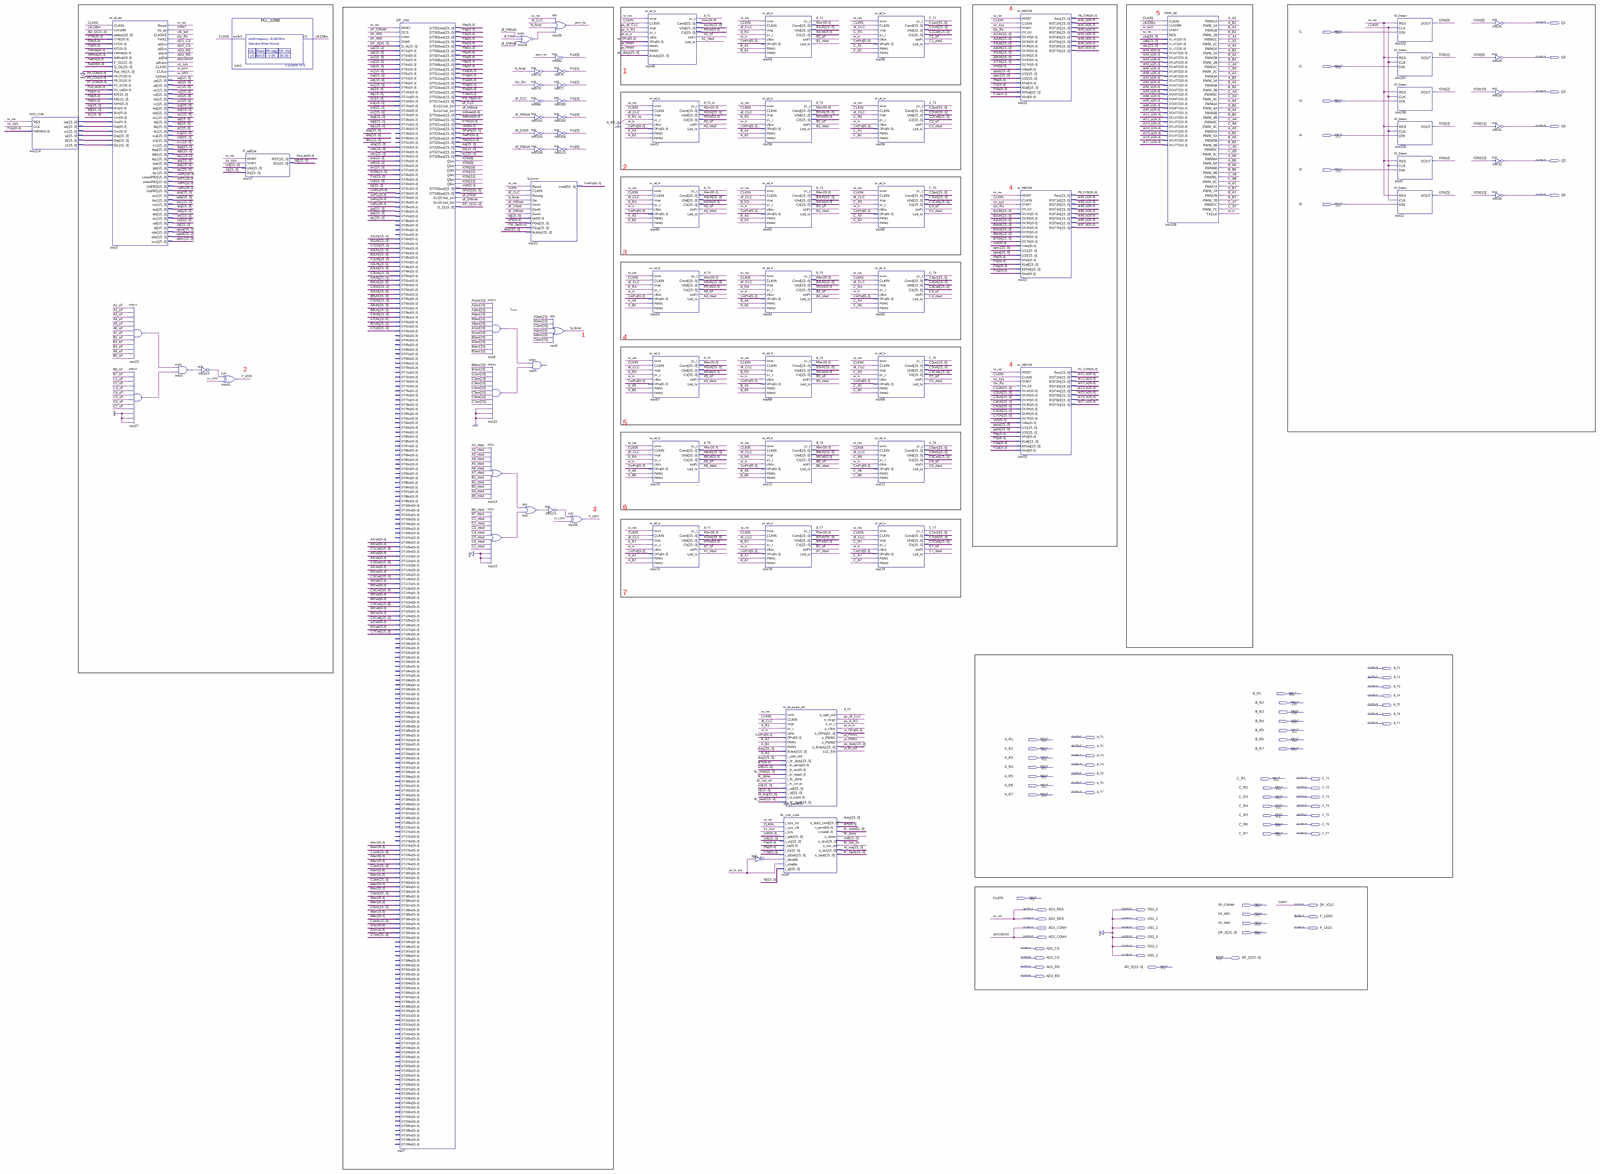
[diagram p0: schematic sheet, whole]
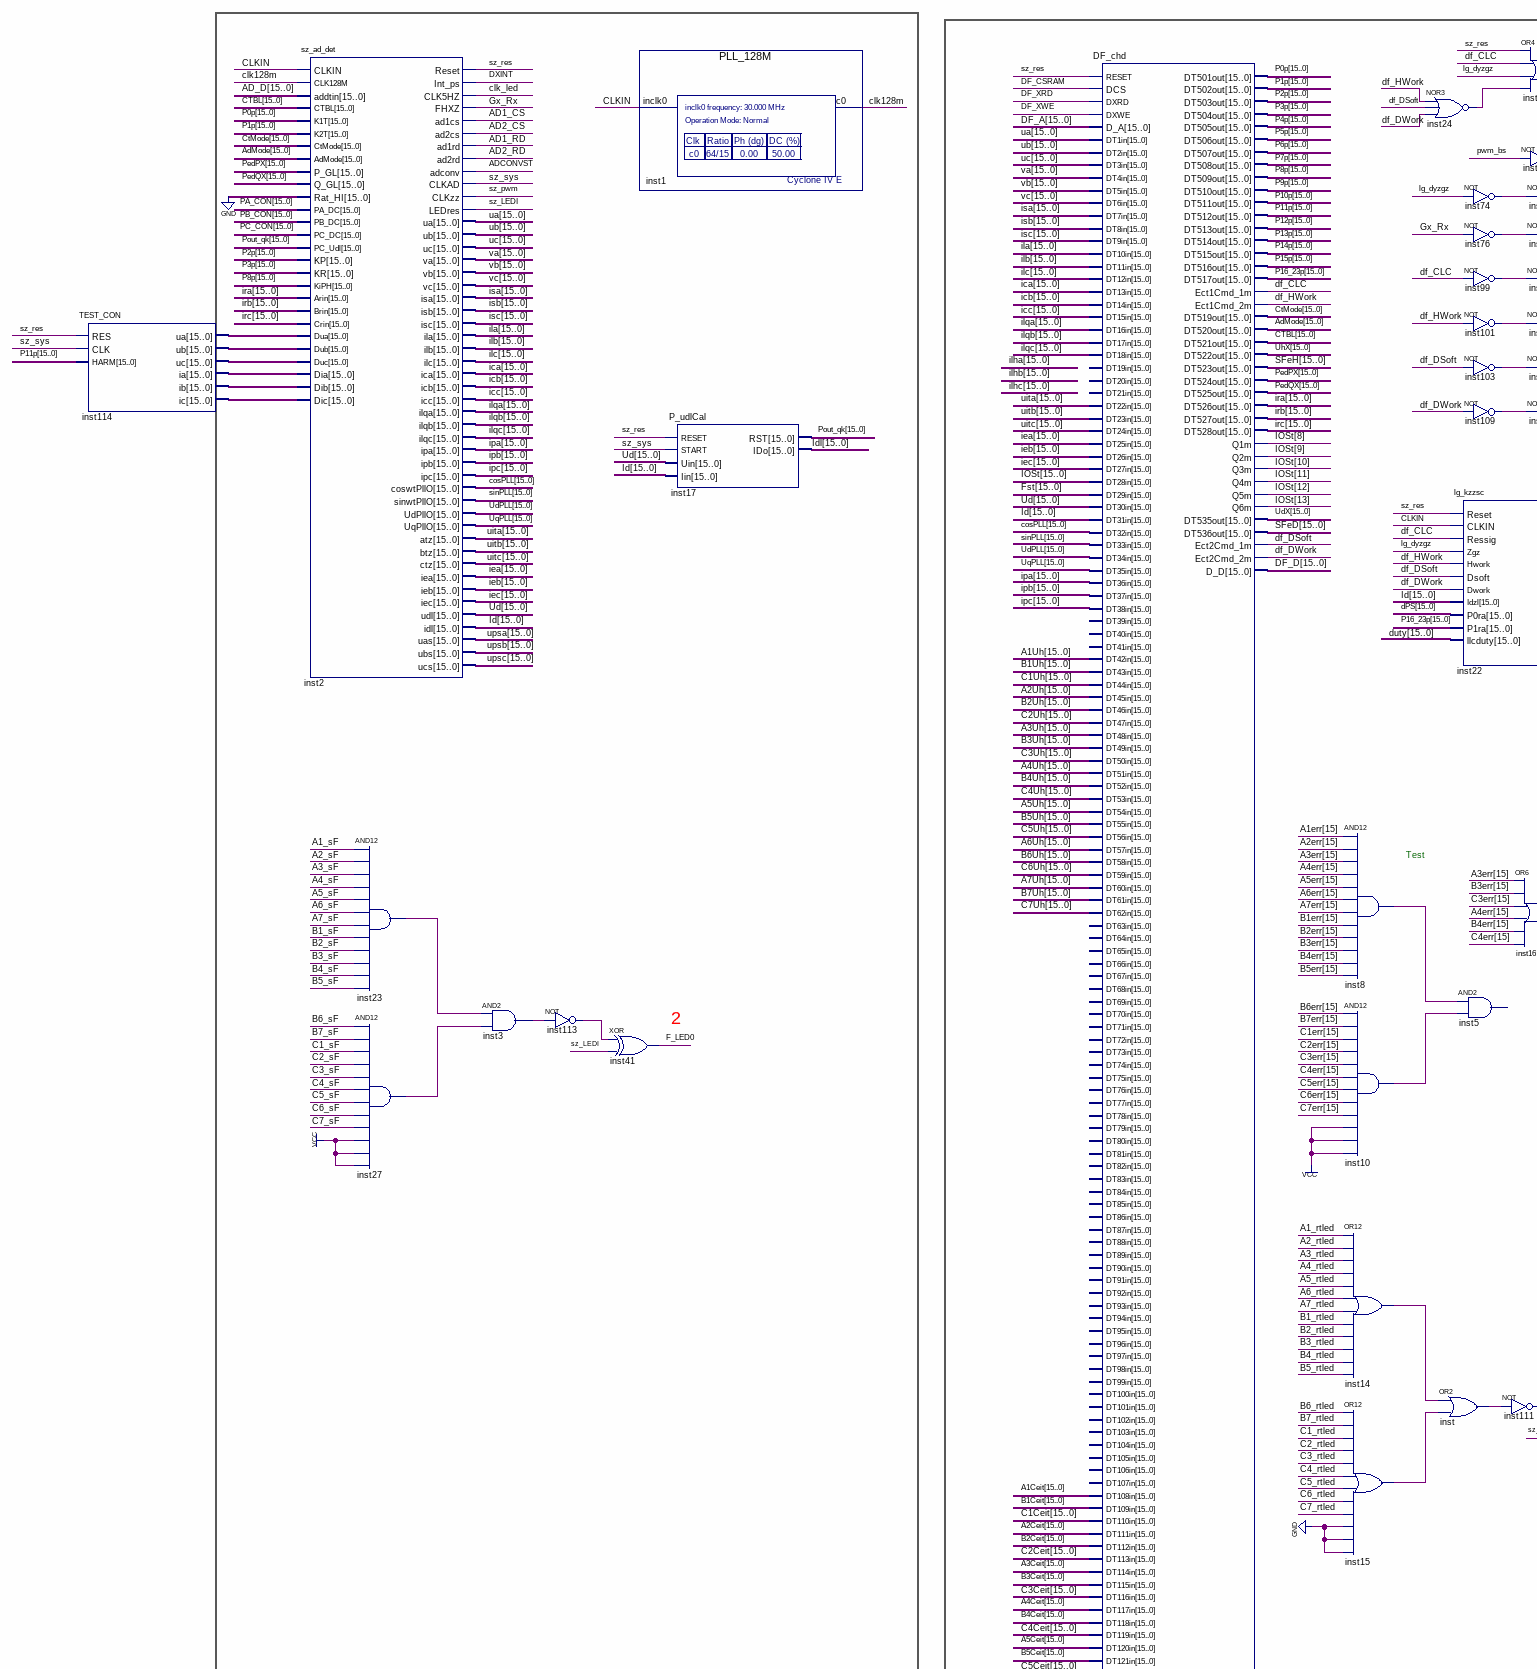
[diagram p1: schematic sheet, upper left part]
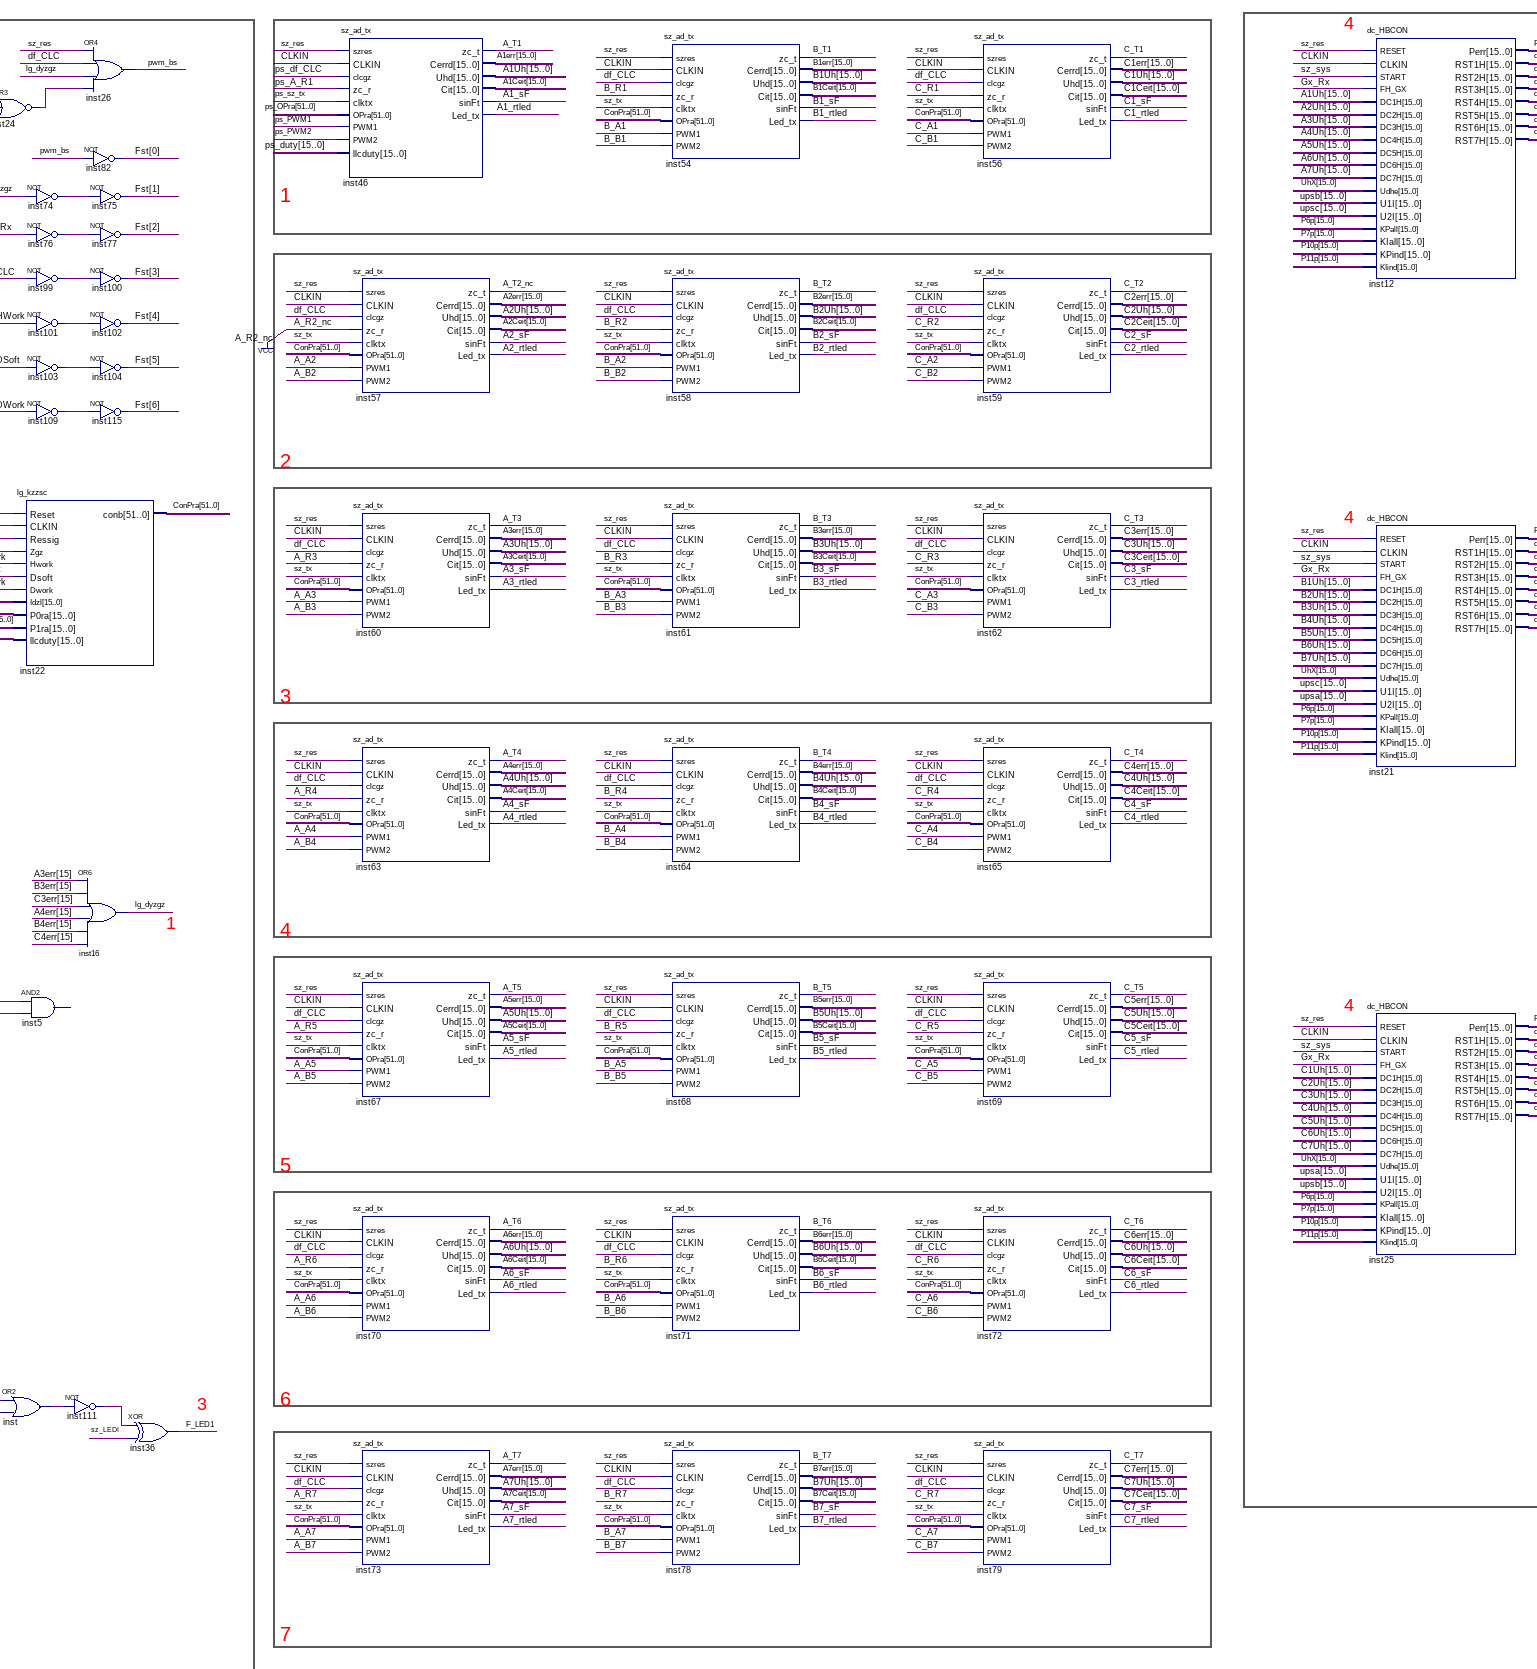
[diagram p2: schematic sheet, upper centre part]
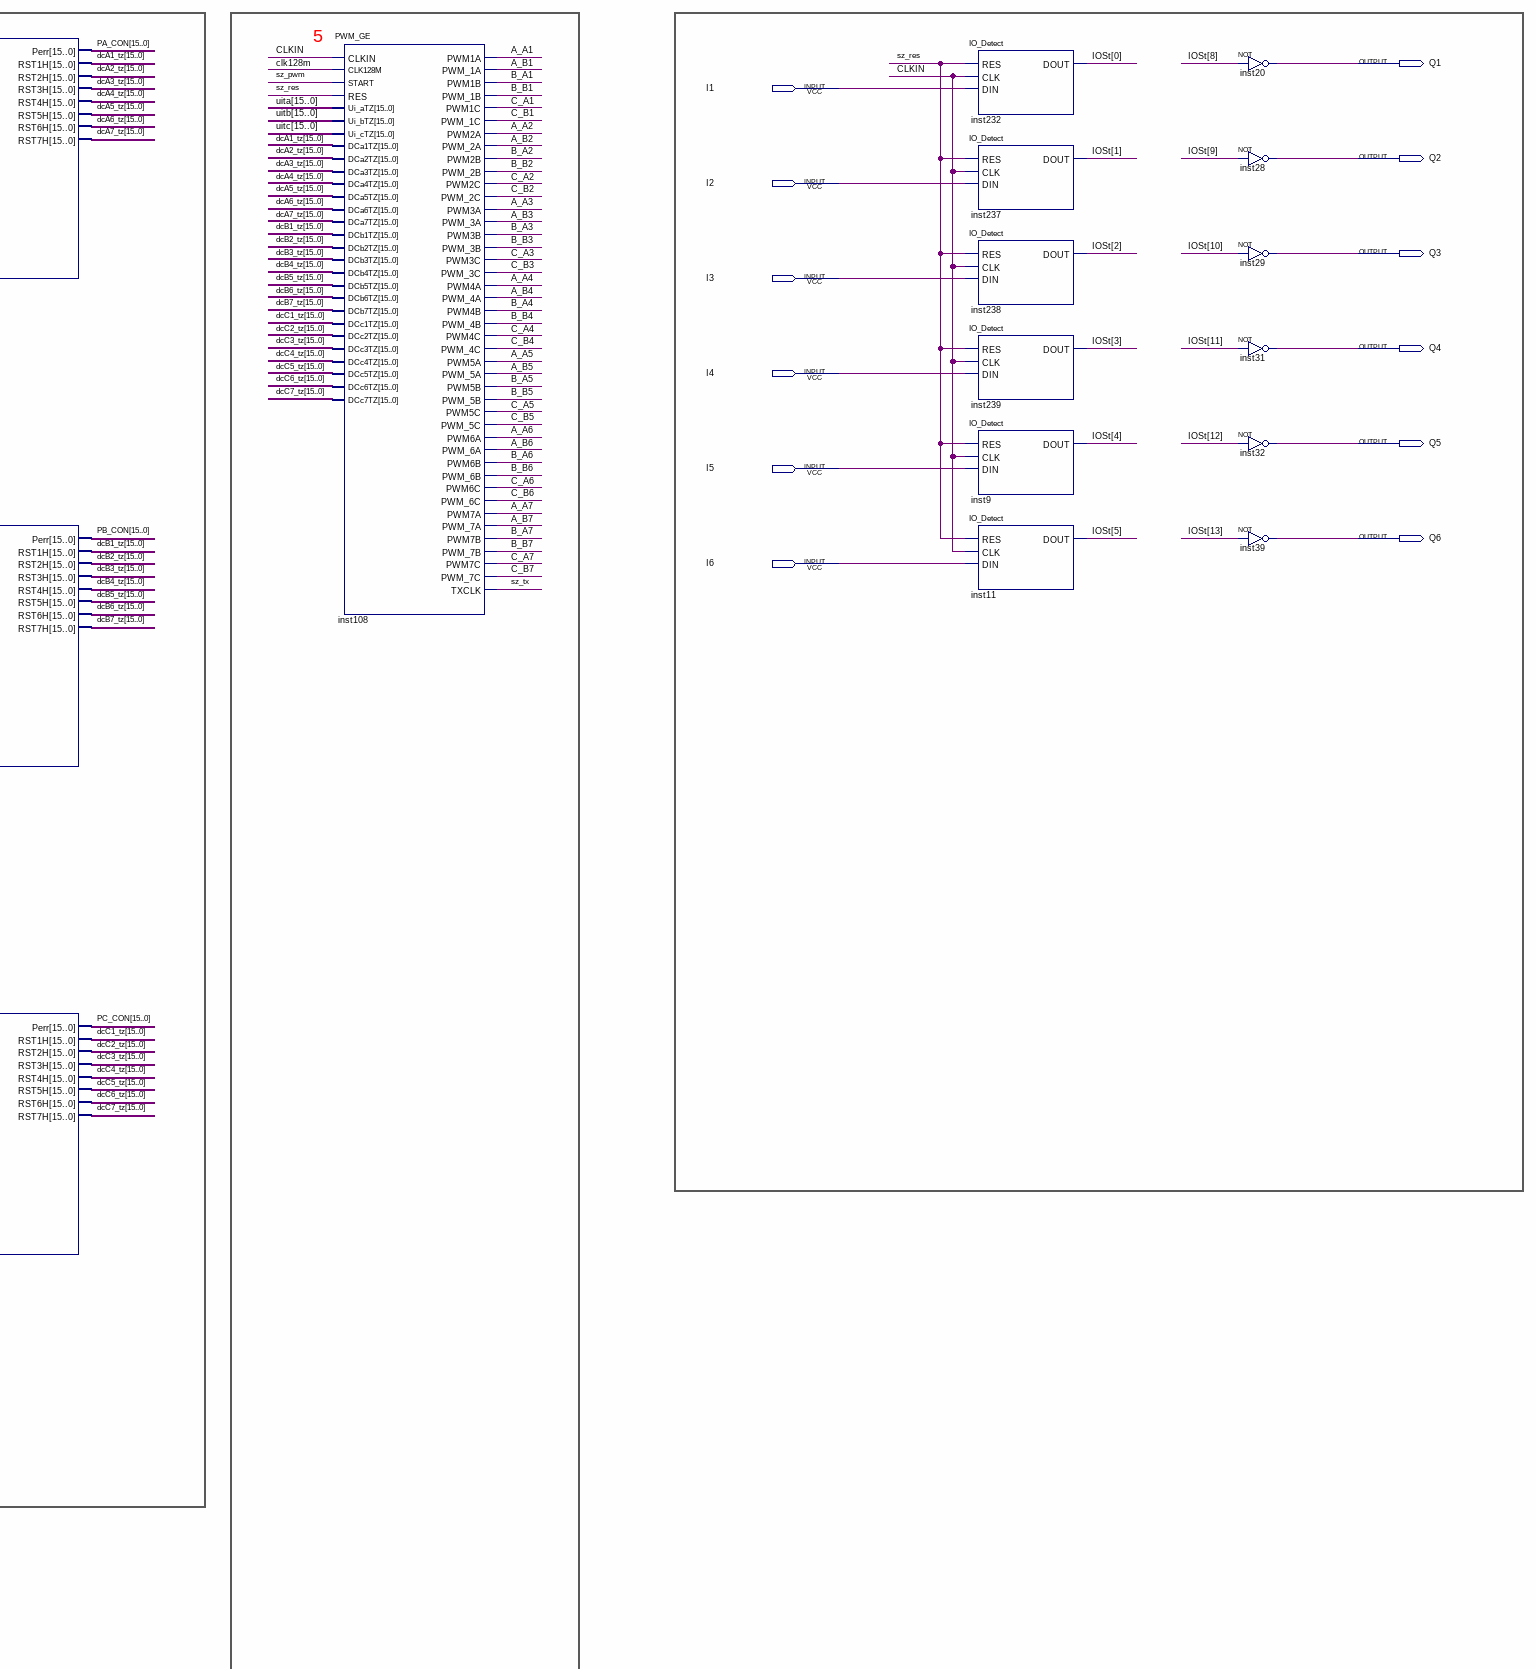
[diagram p3: schematic sheet, upper right part]
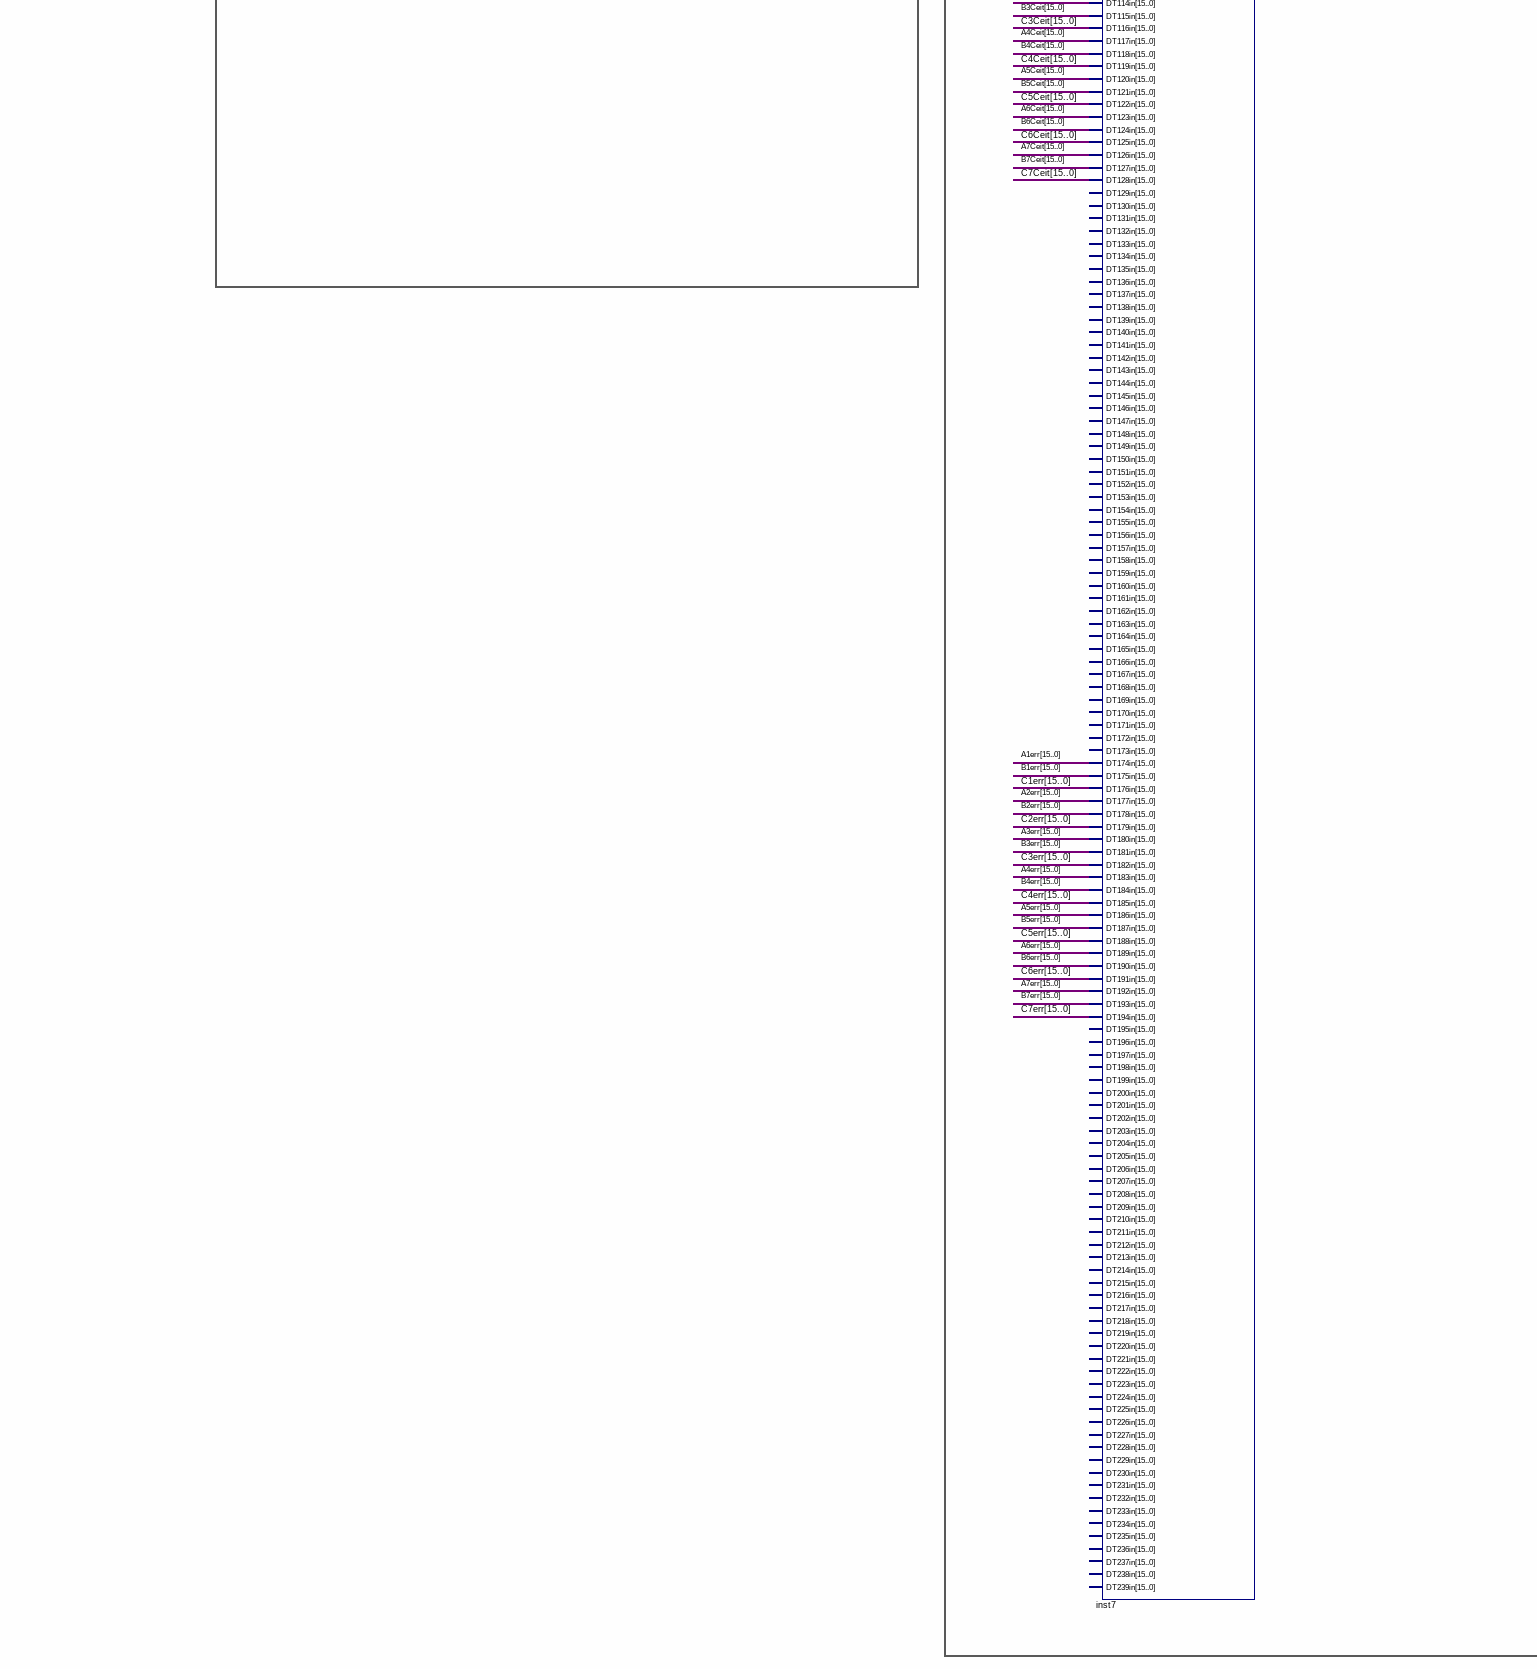
[diagram p4: schematic sheet, lower left part]
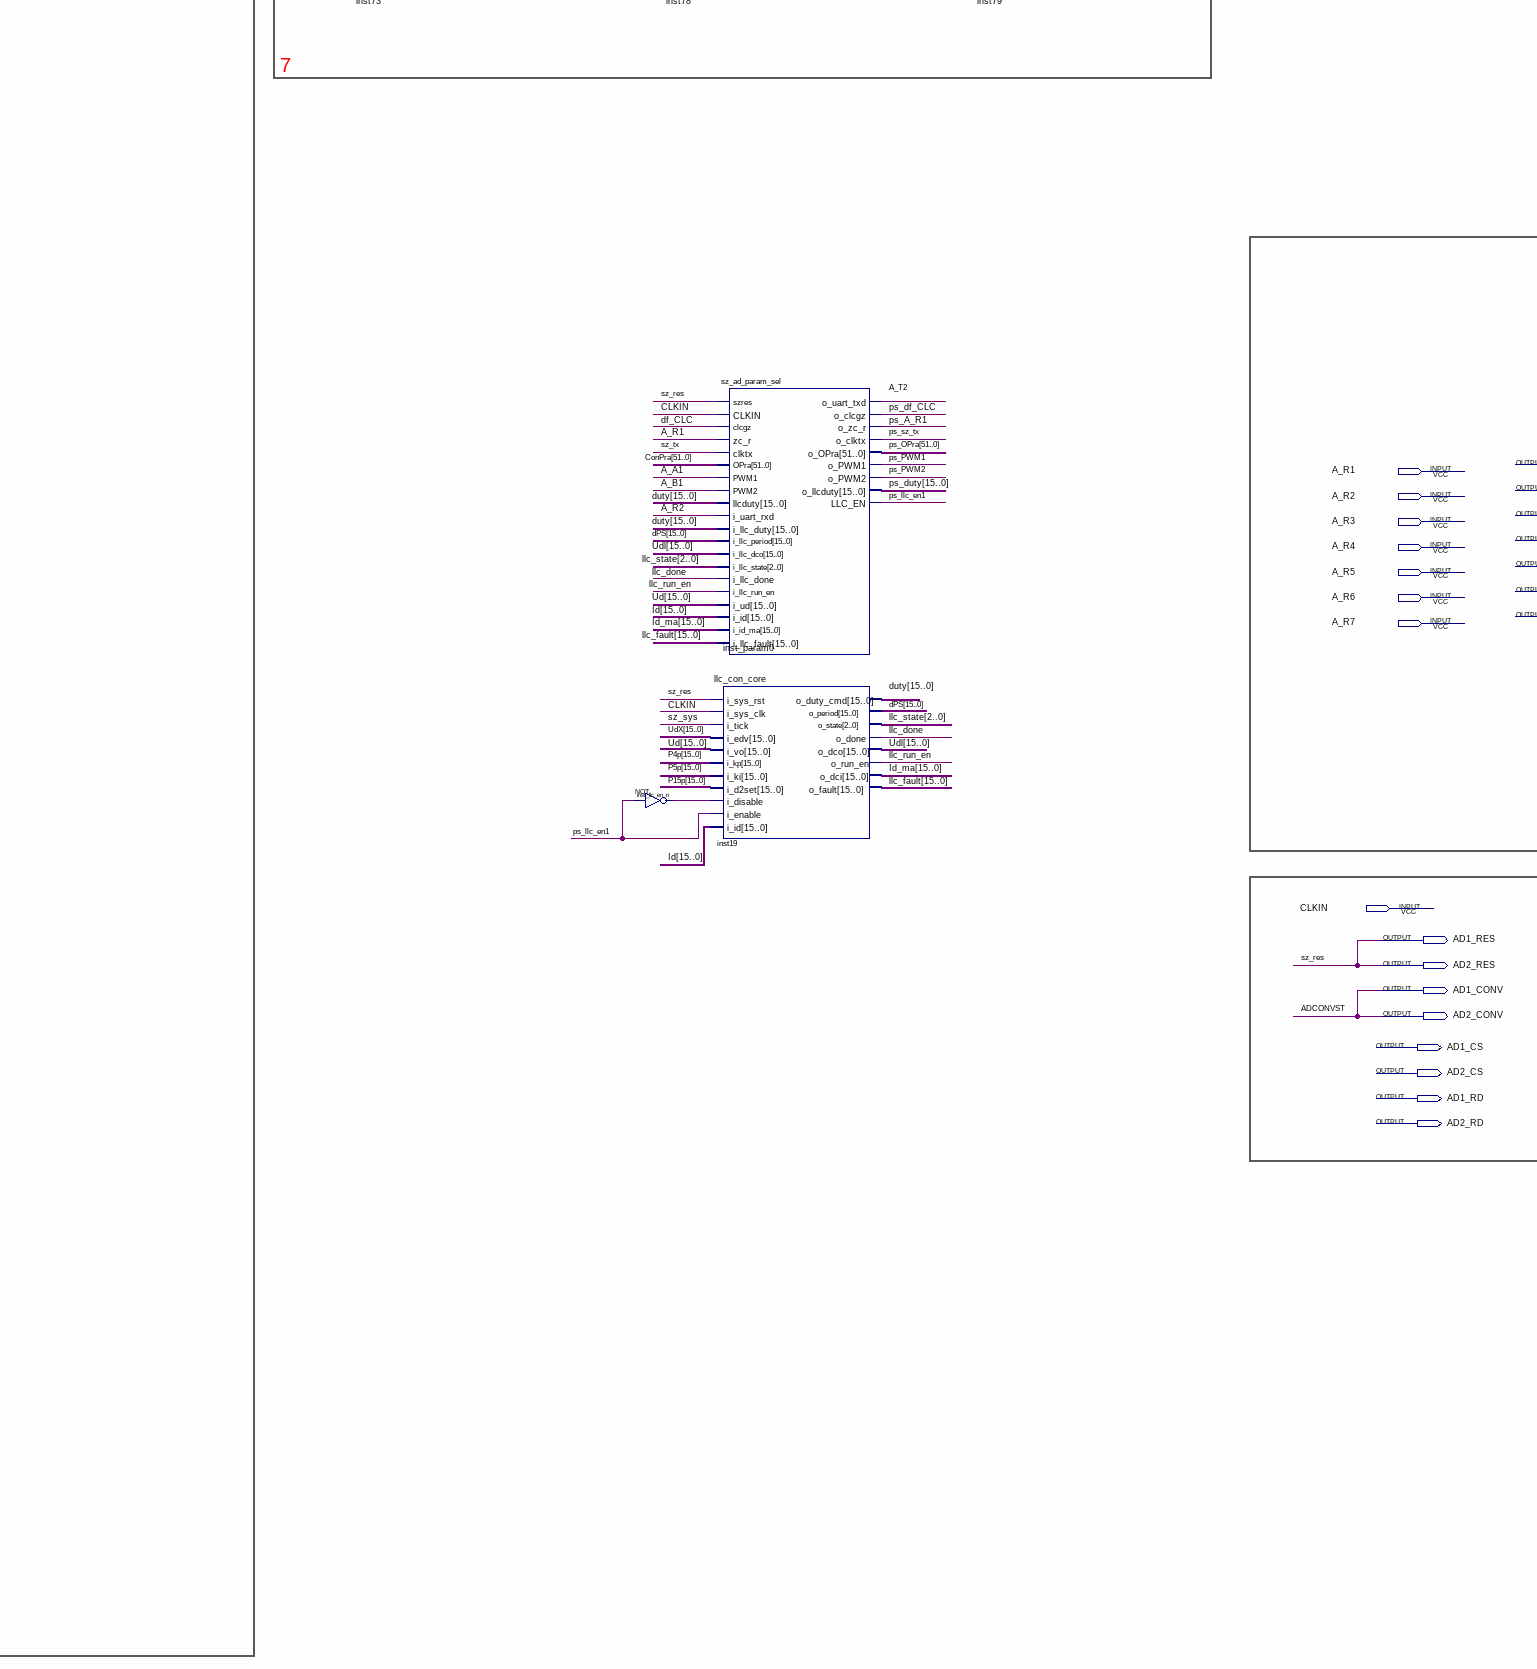
[diagram p5: schematic sheet, lower centre part]
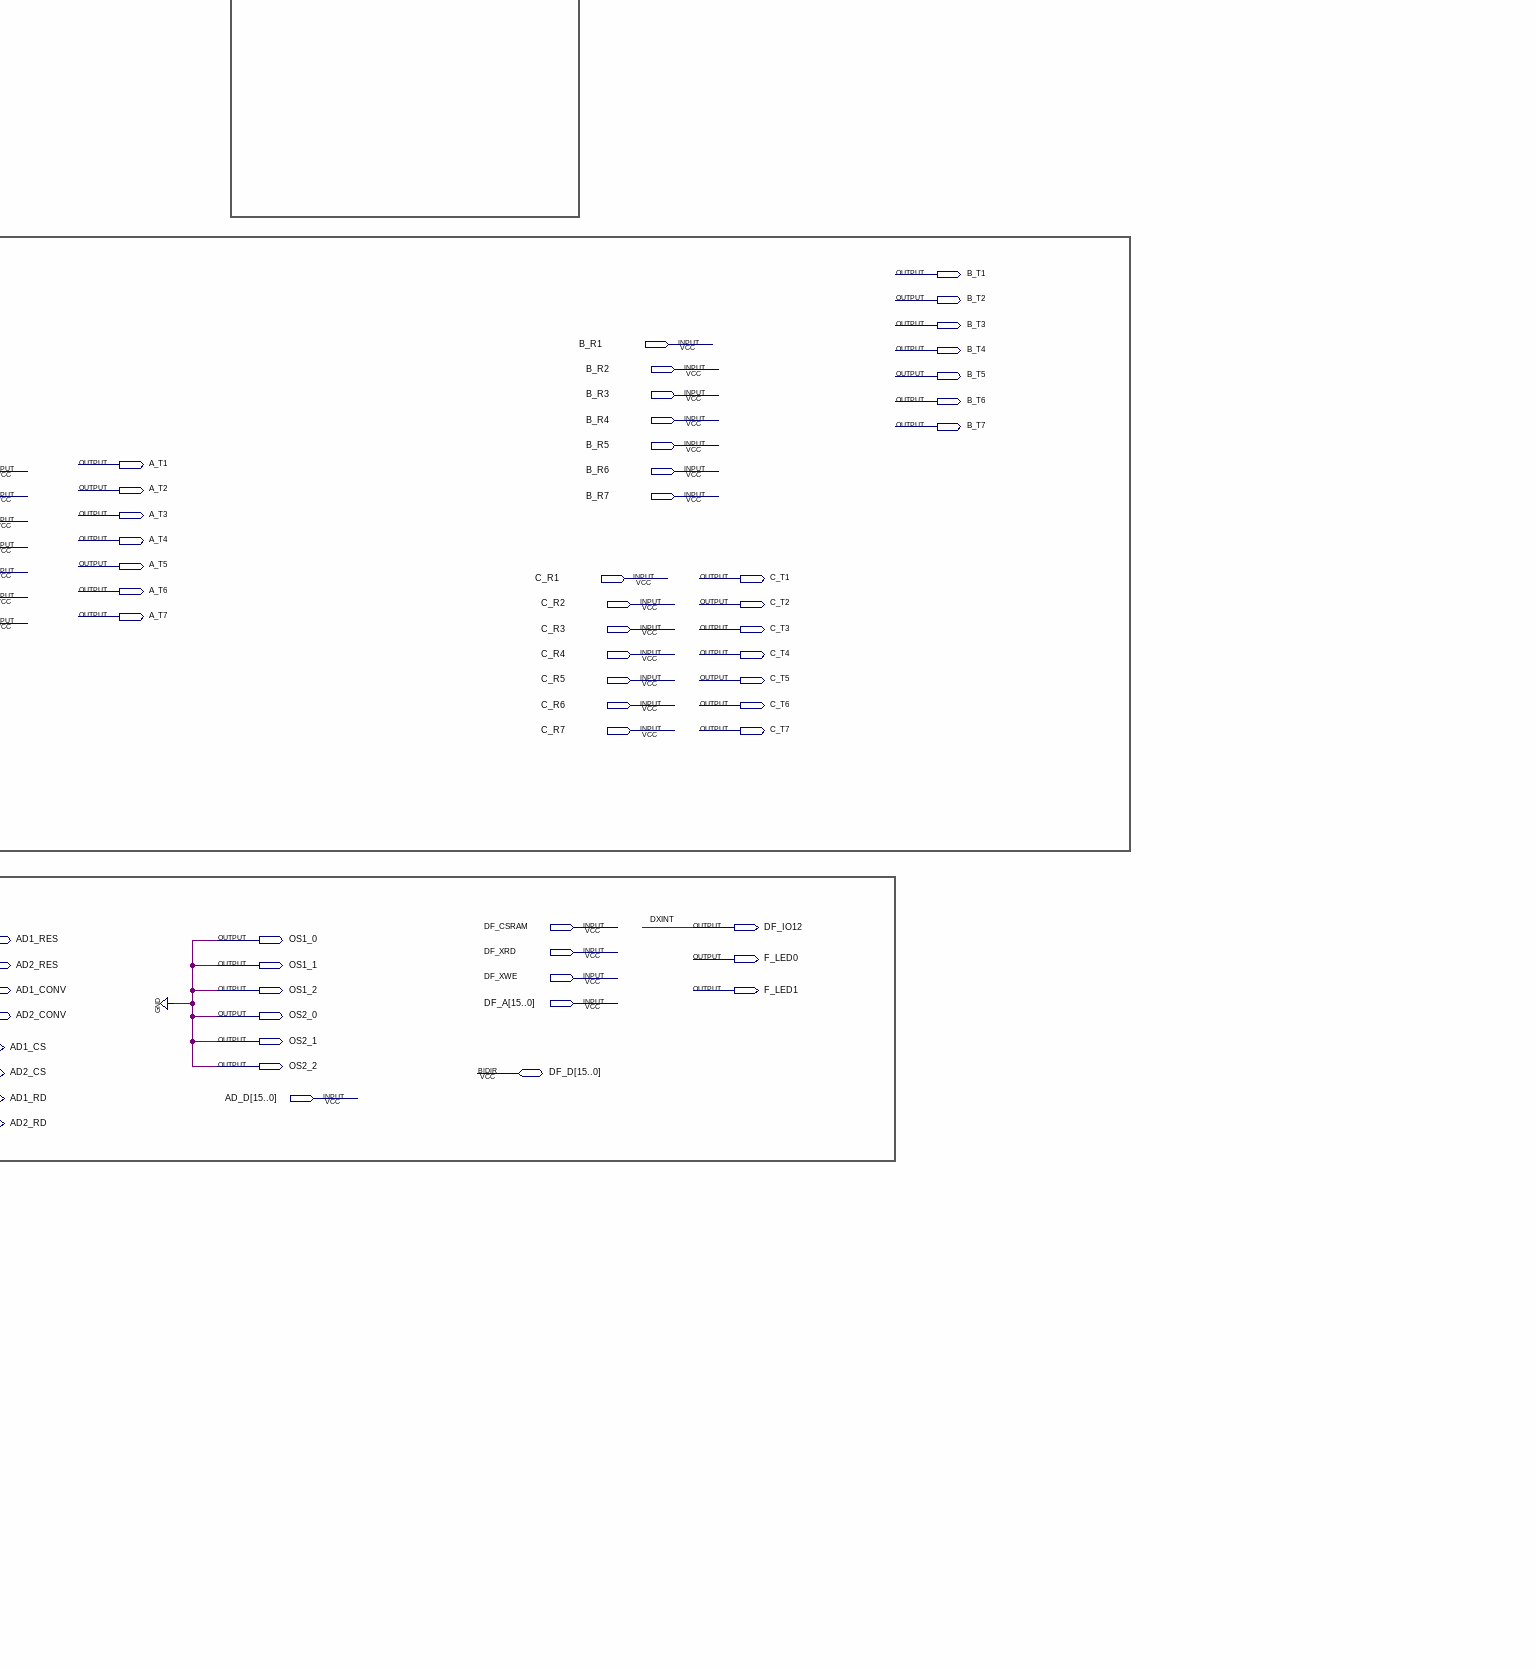
[diagram p6: schematic sheet, lower right part]
// Quartus schematic Z_GCBs.bdf as structural Verilog: 75 symbols, 78 pins
module Z_GCBs (
  input  I1,
  input  I2,
  input  I3,
  input  I4,
  input  I5,
  input  I6,
  input  B_R1,
  input  B_R2,
  input  B_R3,
  input  B_R4,
  input  B_R5,
  input  A_R1,
  input  B_R6,
  input  A_R2,
  input  B_R7,
  input  A_R3,
  input  A_R4,
  input  A_R5,
  input  C_R1,
  input  A_R6,
  input  C_R2,
  input  A_R7,
  input  C_R3,
  input  C_R4,
  input  C_R5,
  input  C_R6,
  input  C_R7,
  input  CLKIN,
  input  DF_CSRAM,
  input  DF_XRD,
  input  DF_XWE,
  input  [15:0] DF_A,
  input  [15:0] AD_D,
  inout  [15:0] DF_D,
  output Q1,
  output Q2,
  output Q3,
  output Q4,
  output Q5,
  output Q6,
  output B_T1,
  output B_T2,
  output B_T3,
  output B_T4,
  output B_T5,
  output B_T6,
  output B_T7,
  output A_T1,
  output A_T2,
  output A_T3,
  output A_T4,
  output A_T5,
  output C_T1,
  output A_T6,
  output C_T2,
  output A_T7,
  output C_T3,
  output C_T4,
  output C_T5,
  output C_T6,
  output C_T7,
  output DF_IO12,
  output AD1_RES,
  output OS1_0,
  output F_LED0,
  output AD2_RES,
  output OS1_1,
  output AD1_CONV,
  output OS1_2,
  output F_LED1,
  output AD2_CONV,
  output OS2_0,
  output OS2_1,
  output AD1_CS,
  output OS2_2,
  output AD2_CS,
  output AD1_RD,
  output AD2_RD
);

  wire A1_rtled, A1_sF, A2_rtled, A2_sF, A3_rtled, A3_sF, A4_rtled, A4_sF, A5_rtled, A5_sF, A6_rtled, A6_sF,
       A7_rtled, A7_sF, A_A1, A_A2, A_A3, A_A4, A_A5, A_A6, A_A7, A_B1, A_B2, A_B3, A_B4, A_B5, A_B6, A_B7,
       A_T2_nc, B1_rtled, B1_sF, B2_rtled, B2_sF, B3_rtled, B3_sF, B4_rtled, B4_sF, B5_rtled, B5_sF,
       B6_rtled, B6_sF, B7_rtled, B7_sF, B_A1, B_A2, B_A3, B_A4, B_A5, B_A6, B_A7, B_B1, B_B2, B_B3, B_B4,
       B_B5, B_B6, B_B7, C1_rtled, C1_sF, C2_rtled, C2_sF, C3_rtled, C3_sF, C4_rtled, C4_sF, C5_rtled, C5_sF,
       C6_rtled, C6_sF, C7_rtled, C7_sF, C_A1, C_A2, C_A3, C_A4, C_A5, C_A6, C_A7, C_B1, C_B2, C_B3, C_B4,
       C_B5, C_B6, C_B7, clk128m, clk_led, df_CLC, df_DSoft, df_DWork, df_HWork, Gx_Rx, inst3_out, inst8_out,
       inst10_out, inst14_out, inst15_out, inst23_out, inst24_out, inst27_out, inst74_out, inst76_out,
       inst99_out, inst101_out, inst103_out, inst109_out, inst111_out, inst113_out, inst_llc_en_n_out,
       inst_out, lg_dyzgz, llc_done, llc_run_en, ps_A_R1, ps_df_CLC, ps_llc_en1, ps_PWM1, ps_PWM2, ps_sz_tx,
       pwm_bs, sz_LEDI, sz_pwm, sz_sys, sz_tx;
  wire [2:0] llc_state;
  wire [15:0] A1Ceit, A1err, A1Uh, A2Ceit, A2err, A2Uh, A3Ceit, A3err, A3Uh, A4Ceit, A4err, A4Uh, A5Ceit,
       A5err, A5Uh, A6Ceit, A6err, A6Uh, A7Ceit, A7err, A7Uh, AdMode, B1Ceit, B1err, B1Uh, B2Ceit, B2err,
       B2Uh, B3Ceit, B3err, B3Uh, B4Ceit, B4err, B4Uh, B5Ceit, B5err, B5Uh, B6Ceit, B6err, B6Uh, B7Ceit,
       B7err, B7Uh, C1Ceit, C1err, C1Uh, C2Ceit, C2err, C2Uh, C3Ceit, C3err, C3Uh, C4Ceit, C4err, C4Uh,
       C5Ceit, C5err, C5Uh, C6Ceit, C6err, C6Uh, C7Ceit, C7err, C7Uh, cosPLL, CTBL, CtMode, dcA1_tz, dcA2_tz,
       dcA3_tz, dcA4_tz, dcA5_tz, dcA6_tz, dcA7_tz, dcB1_tz, dcB2_tz, dcB3_tz, dcB4_tz, dcB5_tz, dcB6_tz,
       dcB7_tz, dcC1_tz, dcC2_tz, dcC3_tz, dcC4_tz, dcC5_tz, dcC6_tz, dcC7_tz, dPS, duty, Fst, ica, icb, icc,
       Id, Id_ma, Idl, iea, ieb, iec, ila, ilb, ilc, ilqa, ilqb, ilqc, inst114_ia, inst114_ib, inst114_ic,
       inst114_ua, inst114_ub, inst114_uc, IOSt, ipa, ipb, ipc, ira, irb, irc, isa, isb, isc, llc_fault, P0p,
       P1p, P2p, P3p, P4p, P5p, P6p, P7p, P8p, P9p, P10p, P11p, P12p, P13p, P14p, P15p, P16_23p, PA_CON,
       PB_CON, PC_CON, PedPX, PedQX, Pout_qk, ps_duty, SFeD, SFeH, sinPLL, ua, ub, uc, Ud, Udl, UdPLL, UdX,
       UhX, uita, uitb, uitc, upsa, upsb, upsc, UqPLL, va, vb, vc;
  wire [51:0] ConPra, ps_OPra;

  TEST_CON inst114 (
    .RES(AD1_RES), .CLK(sz_sys), .HARM(P11p), .ua(inst114_ua), .ub(inst114_ub), .uc(inst114_uc),
    .ia(inst114_ia), .ib(inst114_ib), .ic(inst114_ic));
  sz_ad_det inst2 (
    .CLKIN(CLKIN), .CLK128M(clk128m), .addtin(AD_D), .CTBL(CTBL), .K1T(P0p), .K2T(P1p), .CtMode(CtMode),
    .AdMode(AdMode), .P_GL(PedPX), .Q_GL(PedQX), .Rat_HI({16{1'b0}}), .PA_DC(PA_CON), .PB_DC(PB_CON),
    .PC_DC(PC_CON), .PC_Udl(Pout_qk), .KP(P2p), .KR(P3p), .KiPH(P8p), .Arin(ira), .Brin(irb), .Crin(irc),
    .Dua(inst114_ua), .Dub(inst114_ub), .Duc(inst114_uc), .Dia(inst114_ia), .Dib(inst114_ib),
    .Dic(inst114_ic), .Reset(AD1_RES), .Int_ps(DF_IO12), .CLK5HZ(clk_led), .FHXZ(Gx_Rx), .ad1cs(AD1_CS),
    .ad2cs(AD2_CS), .ad1rd(AD1_RD), .ad2rd(AD2_RD), .adconv(AD1_CONV), .CLKAD(sz_sys), .CLKzz(sz_pwm),
    .LEDres(sz_LEDI), .ua(ua), .ub(ub), .uc(uc), .va(va), .vb(vb), .vc(vc), .isa(isa), .isb(isb), .isc(isc),
    .ila(ila), .ilb(ilb), .ilc(ilc), .ica(ica), .icb(icb), .icc(icc), .ilqa(ilqa), .ilqb(ilqb), .ilqc(ilqc),
    .ipa(ipa), .ipb(ipb), .ipc(ipc), .coswtPllO(cosPLL), .sinwtPllO(sinPLL), .UdPllO(UdPLL), .UqPllO(UqPLL),
    .atz(uita), .btz(uitb), .ctz(uitc), .iea(iea), .ieb(ieb), .iec(iec), .udl(Ud), .idl(Id), .uas(upsa),
    .ubs(upsb), .ucs(upsc));
  and inst23 (inst23_out, A1_sF, A2_sF, A3_sF, A4_sF, A5_sF, A6_sF, A7_sF, B1_sF, B2_sF, B3_sF, B4_sF, B5_sF);
  and inst27 (inst27_out, B6_sF, B7_sF, C1_sF, C2_sF, C3_sF, C4_sF, C5_sF, C6_sF, C7_sF, 1'b1, 1'b1, 1'b1);
  and inst3 (inst3_out, inst23_out, inst27_out);
  not inst113 (inst113_out, inst3_out);
  PLL_128M inst1 (.inclk0(CLKIN), .c0(clk128m));
  xor inst41 (F_LED0, inst113_out, sz_LEDI);
  P_udlCal inst17 (.RESET(AD1_RES), .START(sz_sys), .Uin(Ud), .Iin(Id), .RST(Pout_qk), .IDo(Idl));
  DF_chd inst7 (
    .RESET(AD1_RES), .DCS(DF_CSRAM), .DXRD(DF_XRD), .DXWE(DF_XWE), .D_A(DF_A), .DT1in(ua), .DT2in(ub),
    .DT3in(uc), .DT4in(va), .DT5in(vb), .DT6in(vc), .DT7in(isa), .DT8in(isb), .DT9in(isc), .DT10in(ila),
    .DT11in(ilb), .DT12in(ilc), .DT13in(ica), .DT14in(icb), .DT15in(icc), .DT16in(ilqa), .DT17in(ilqb),
    .DT18in(ilqc), .DT22in(uita), .DT23in(uitb), .DT24in(uitc), .DT25in(iea), .DT26in(ieb), .DT27in(iec),
    .DT28in(IOSt), .DT29in(Fst), .DT30in(Ud), .DT31in(Id), .DT32in(cosPLL), .DT33in(sinPLL), .DT34in(UdPLL),
    .DT35in(UqPLL), .DT36in(ipa), .DT37in(ipb), .DT38in(ipc), .DT42in(A1Uh), .DT43in(B1Uh), .DT44in(C1Uh),
    .DT45in(A2Uh), .DT46in(B2Uh), .DT47in(C2Uh), .DT48in(A3Uh), .DT49in(B3Uh), .DT50in(C3Uh), .DT51in(A4Uh),
    .DT52in(B4Uh), .DT53in(C4Uh), .DT54in(A5Uh), .DT55in(B5Uh), .DT56in(C5Uh), .DT57in(A6Uh), .DT58in(B6Uh),
    .DT59in(C6Uh), .DT60in(A7Uh), .DT61in(B7Uh), .DT62in(C7Uh), .DT108in(A1Ceit), .DT109in(B1Ceit),
    .DT110in(C1Ceit), .DT111in(A2Ceit), .DT112in(B2Ceit), .DT113in(C2Ceit), .DT114in(A3Ceit),
    .DT115in(B3Ceit), .DT116in(C3Ceit), .DT117in(A4Ceit), .DT118in(B4Ceit), .DT119in(C4Ceit),
    .DT120in(A5Ceit), .DT121in(B5Ceit), .DT122in(C5Ceit), .DT123in(A6Ceit), .DT124in(B6Ceit),
    .DT125in(C6Ceit), .DT126in(A7Ceit), .DT127in(B7Ceit), .DT128in(C7Ceit), .DT174in(A1err), .DT175in(B1err),
    .DT176in(C1err), .DT177in(A2err), .DT178in(B2err), .DT179in(C2err), .DT180in(A3err), .DT181in(B3err),
    .DT182in(C3err), .DT183in(A4err), .DT184in(B4err), .DT185in(C4err), .DT186in(A5err), .DT187in(B5err),
    .DT188in(C5err), .DT189in(A6err), .DT190in(B6err), .DT191in(C6err), .DT192in(A7err), .DT193in(B7err),
    .DT194in(C7err), .DT501out(P0p), .DT502out(P1p), .DT503out(P2p), .DT504out(P3p), .DT505out(P4p),
    .DT506out(P5p), .DT507out(P6p), .DT508out(P7p), .DT509out(P8p), .DT510out(P9p), .DT511out(P10p),
    .DT512out(P11p), .DT513out(P12p), .DT514out(P13p), .DT515out(P14p), .DT516out(P15p), .DT517out(P16_23p),
    .Ect1Cmd_1m(df_CLC), .Ect1Cmd_2m(df_HWork), .DT519out(CtMode), .DT520out(AdMode), .DT521out(CTBL),
    .DT522out(UhX), .DT523out(SFeH), .DT524out(PedPX), .DT525out(PedQX), .DT526out(ira), .DT527out(irb),
    .DT528out(irc), .Q1m(IOSt[8]), .Q2m(IOSt[9]), .Q3m(IOSt[10]), .Q4m(IOSt[11]), .Q5m(IOSt[12]),
    .Q6m(IOSt[13]), .DT535out(UdX), .DT536out(SFeD), .Ect2Cmd_1m(df_DSoft), .Ect2Cmd_2m(df_DWork), .D_D(DF_D));  // open: DT19in, DT20in, DT21in, DT39in, DT40in, DT41in, DT63in, DT64in, DT65in, DT66in, DT67in, DT68in, DT69in, DT70in, DT71in, DT72in, DT73in, DT74in, DT75in, DT76in, DT77in, DT78in, DT79in, DT80in, DT81in, DT82in, DT83in, DT84in, DT85in, DT86in, DT87in, DT88in, DT89in, DT90in, DT91in, DT92in, DT93in, DT94in, DT95in, DT96in, DT97in, DT98in, DT99in, DT100in, DT101in, DT102in, DT103in, DT104in, DT105in, DT106in, DT107in, DT129in, DT130in, DT131in, DT132in, DT133in, DT134in, DT135in, DT136in, DT137in, DT138in, DT139in, DT140in, DT141in, DT142in, DT143in, DT144in, DT145in, DT146in, DT147in, DT148in, DT149in, DT150in, DT151in, DT152in, DT153in, DT154in, DT155in, DT156in, DT157in, DT158in, DT159in, DT160in, DT161in, DT162in, DT163in, DT164in, DT165in, DT166in, DT167in, DT168in, DT169in, DT170in, DT171in, DT172in, DT173in, DT195in, DT196in, DT197in, DT198in, DT199in, DT200in, DT201in, DT202in, DT203in, DT204in, DT205in, DT206in, DT207in, DT208in, DT209in, DT210in, DT211in, DT212in, DT213in, DT214in, DT215in, DT216in, DT217in, DT218in, DT219in, DT220in, DT221in, DT222in, DT223in, DT224in, DT225in, DT226in, DT227in, DT228in, DT229in, DT230in, DT231in, DT232in, DT233in, DT234in, DT235in, DT236in, DT237in, DT238in, DT239in
  and inst8 (inst8_out, A1err[15], A2err[15], A3err[15], A4err[15], A5err[15], A6err[15], A7err[15], B1err[15], B2err[15], B3err[15], B4err[15], B5err[15]);
  and inst10 (inst10_out, B6err[15], B7err[15], C1err[15], C2err[15], C3err[15], C4err[15], C5err[15], C6err[15], C7err[15], 1'b1, 1'b1, 1'b1);
  or inst14 (inst14_out, A1_rtled, A2_rtled, A3_rtled, A4_rtled, A5_rtled, A6_rtled, A7_rtled, B1_rtled, B2_rtled, B3_rtled, B4_rtled, B5_rtled);
  or inst15 (inst15_out, B6_rtled, B7_rtled, C1_rtled, C2_rtled, C3_rtled, C4_rtled, C5_rtled, C6_rtled, C7_rtled, 1'b0, 1'b0, 1'b0);
  nor inst24 (inst24_out, df_HWork, df_DSoft, df_DWork);
  lg_kzzsc inst22 (
    .Reset(AD1_RES), .CLKIN(CLKIN), .Ressig(df_CLC), .Zgz(lg_dyzgz), .Hwork(df_HWork), .Dsoft(df_DSoft),
    .Dwork(df_DWork), .Idzl(Id), .P0ra(dPS), .P1ra(P16_23p), .llcduty(duty), .conb(ConPra));
  // AND2 inst5 has open pins: IN1=inst8_out, IN2=inst10_out, OUT=open
  or inst (inst_out, inst14_out, inst15_out);
  not inst74 (inst74_out, lg_dyzgz);
  not inst76 (inst76_out, Gx_Rx);
  not inst99 (inst99_out, df_CLC);
  not inst101 (inst101_out, df_HWork);
  not inst103 (inst103_out, df_DSoft);
  not inst109 (inst109_out, df_DWork);
  not inst111 (inst111_out, inst_out);
  or inst26 (pwm_bs, AD1_RES, df_CLC, lg_dyzgz, inst24_out);
  not inst82 (Fst[0], pwm_bs);
  not inst75 (Fst[1], inst74_out);
  not inst77 (Fst[2], inst76_out);
  not inst100 (Fst[3], inst99_out);
  not inst102 (Fst[4], inst101_out);
  not inst104 (Fst[5], inst103_out);
  not inst115 (Fst[6], inst109_out);
  or inst16 (lg_dyzgz, A3err[15], B3err[15], C3err[15], A4err[15], B4err[15], C4err[15]);
  xor inst36 (F_LED1, inst111_out, sz_LEDI);
  sz_ad_tx inst46 (
    .szres(AD1_RES), .CLKIN(CLKIN), .clcgz(ps_df_CLC), .zc_r(ps_A_R1), .clktx(ps_sz_tx), .OPra(ps_OPra),
    .PWM1(ps_PWM1), .PWM2(ps_PWM2), .llcduty(ps_duty), .zc_t(A_T1), .Cerrd(A1err), .Uhd(A1Uh), .Cit(A1Ceit),
    .sinFt(A1_sF), .Led_tx(A1_rtled));
  sz_ad_tx inst57 (
    .szres(AD1_RES), .CLKIN(CLKIN), .clcgz(df_CLC), .zc_r(1'b1), .clktx(sz_tx), .OPra(ConPra), .PWM1(A_A2),
    .PWM2(A_B2), .zc_t(A_T2_nc), .Cerrd(A2err), .Uhd(A2Uh), .Cit(A2Ceit), .sinFt(A2_sF), .Led_tx(A2_rtled));
  sz_ad_tx inst60 (
    .szres(AD1_RES), .CLKIN(CLKIN), .clcgz(df_CLC), .zc_r(A_R3), .clktx(sz_tx), .OPra(ConPra), .PWM1(A_A3),
    .PWM2(A_B3), .zc_t(A_T3), .Cerrd(A3err), .Uhd(A3Uh), .Cit(A3Ceit), .sinFt(A3_sF), .Led_tx(A3_rtled));
  sz_ad_tx inst63 (
    .szres(AD1_RES), .CLKIN(CLKIN), .clcgz(df_CLC), .zc_r(A_R4), .clktx(sz_tx), .OPra(ConPra), .PWM1(A_A4),
    .PWM2(A_B4), .zc_t(A_T4), .Cerrd(A4err), .Uhd(A4Uh), .Cit(A4Ceit), .sinFt(A4_sF), .Led_tx(A4_rtled));
  sz_ad_tx inst67 (
    .szres(AD1_RES), .CLKIN(CLKIN), .clcgz(df_CLC), .zc_r(A_R5), .clktx(sz_tx), .OPra(ConPra), .PWM1(A_A5),
    .PWM2(A_B5), .zc_t(A_T5), .Cerrd(A5err), .Uhd(A5Uh), .Cit(A5Ceit), .sinFt(A5_sF), .Led_tx(A5_rtled));
  sz_ad_tx inst70 (
    .szres(AD1_RES), .CLKIN(CLKIN), .clcgz(df_CLC), .zc_r(A_R6), .clktx(sz_tx), .OPra(ConPra), .PWM1(A_A6),
    .PWM2(A_B6), .zc_t(A_T6), .Cerrd(A6err), .Uhd(A6Uh), .Cit(A6Ceit), .sinFt(A6_sF), .Led_tx(A6_rtled));
  sz_ad_tx inst73 (
    .szres(AD1_RES), .CLKIN(CLKIN), .clcgz(df_CLC), .zc_r(A_R7), .clktx(sz_tx), .OPra(ConPra), .PWM1(A_A7),
    .PWM2(A_B7), .zc_t(A_T7), .Cerrd(A7err), .Uhd(A7Uh), .Cit(A7Ceit), .sinFt(A7_sF), .Led_tx(A7_rtled));
  sz_ad_tx inst54 (
    .szres(AD1_RES), .CLKIN(CLKIN), .clcgz(df_CLC), .zc_r(B_R1), .clktx(sz_tx), .OPra(ConPra), .PWM1(B_A1),
    .PWM2(B_B1), .zc_t(B_T1), .Cerrd(B1err), .Uhd(B1Uh), .Cit(B1Ceit), .sinFt(B1_sF), .Led_tx(B1_rtled));
  sz_ad_tx inst58 (
    .szres(AD1_RES), .CLKIN(CLKIN), .clcgz(df_CLC), .zc_r(B_R2), .clktx(sz_tx), .OPra(ConPra), .PWM1(B_A2),
    .PWM2(B_B2), .zc_t(B_T2), .Cerrd(B2err), .Uhd(B2Uh), .Cit(B2Ceit), .sinFt(B2_sF), .Led_tx(B2_rtled));
  sz_ad_tx inst61 (
    .szres(AD1_RES), .CLKIN(CLKIN), .clcgz(df_CLC), .zc_r(B_R3), .clktx(sz_tx), .OPra(ConPra), .PWM1(B_A3),
    .PWM2(B_B3), .zc_t(B_T3), .Cerrd(B3err), .Uhd(B3Uh), .Cit(B3Ceit), .sinFt(B3_sF), .Led_tx(B3_rtled));
  sz_ad_tx inst64 (
    .szres(AD1_RES), .CLKIN(CLKIN), .clcgz(df_CLC), .zc_r(B_R4), .clktx(sz_tx), .OPra(ConPra), .PWM1(B_A4),
    .PWM2(B_B4), .zc_t(B_T4), .Cerrd(B4err), .Uhd(B4Uh), .Cit(B4Ceit), .sinFt(B4_sF), .Led_tx(B4_rtled));
  sz_ad_tx inst68 (
    .szres(AD1_RES), .CLKIN(CLKIN), .clcgz(df_CLC), .zc_r(B_R5), .clktx(sz_tx), .OPra(ConPra), .PWM1(B_A5),
    .PWM2(B_B5), .zc_t(B_T5), .Cerrd(B5err), .Uhd(B5Uh), .Cit(B5Ceit), .sinFt(B5_sF), .Led_tx(B5_rtled));
  sz_ad_tx inst71 (
    .szres(AD1_RES), .CLKIN(CLKIN), .clcgz(df_CLC), .zc_r(B_R6), .clktx(sz_tx), .OPra(ConPra), .PWM1(B_A6),
    .PWM2(B_B6), .zc_t(B_T6), .Cerrd(B6err), .Uhd(B6Uh), .Cit(B6Ceit), .sinFt(B6_sF), .Led_tx(B6_rtled));
  sz_ad_tx inst78 (
    .szres(AD1_RES), .CLKIN(CLKIN), .clcgz(df_CLC), .zc_r(B_R7), .clktx(sz_tx), .OPra(ConPra), .PWM1(B_A7),
    .PWM2(B_B7), .zc_t(B_T7), .Cerrd(B7err), .Uhd(B7Uh), .Cit(B7Ceit), .sinFt(B7_sF), .Led_tx(B7_rtled));
  not inst_llc_en_n (inst_llc_en_n_out, ps_llc_en1);
  sz_ad_param_sel #(.SIM_MODE("true"), .CLK_FREQ(30000000), .UART_BPS(115200)) inst_param0 (
    .szres(AD1_RES), .CLKIN(CLKIN), .clcgz(df_CLC), .zc_r(A_R1), .clktx(sz_tx), .OPra(ConPra), .PWM1(A_A1),
    .PWM2(A_B1), .llcduty(duty), .i_uart_rxd(A_R2), .i_llc_duty(duty), .i_llc_period(dPS), .i_llc_dco(Udl),
    .i_llc_state(llc_state), .i_llc_done(llc_done), .i_llc_run_en(llc_run_en), .i_ud(Ud), .i_id(Id),
    .i_id_ma(Id_ma), .i_llc_fault(llc_fault), .o_uart_txd(A_T2), .o_clcgz(ps_df_CLC), .o_zc_r(ps_A_R1),
    .o_clktx(ps_sz_tx), .o_OPra(ps_OPra), .o_PWM1(ps_PWM1), .o_PWM2(ps_PWM2), .o_llcduty(ps_duty),
    .LLC_EN(ps_llc_en1));
  llc_con_core inst19 (
    .i_sys_rst(AD1_RES), .i_sys_clk(CLKIN), .i_tick(sz_sys), .i_edv(UdX), .i_vo(Ud), .i_kp(P4p), .i_ki(P5p),
    .i_d2set(P15p), .i_disable(inst_llc_en_n_out), .i_enable(ps_llc_en1), .i_id(Id), .o_duty_cmd(duty),
    .o_period(dPS), .o_state(llc_state), .o_done(llc_done), .o_dco(Udl), .o_run_en(llc_run_en),
    .o_dci(Id_ma), .o_fault(llc_fault));
  sz_ad_tx inst56 (
    .szres(AD1_RES), .CLKIN(CLKIN), .clcgz(df_CLC), .zc_r(C_R1), .clktx(sz_tx), .OPra(ConPra), .PWM1(C_A1),
    .PWM2(C_B1), .zc_t(C_T1), .Cerrd(C1err), .Uhd(C1Uh), .Cit(C1Ceit), .sinFt(C1_sF), .Led_tx(C1_rtled));
  sz_ad_tx inst59 (
    .szres(AD1_RES), .CLKIN(CLKIN), .clcgz(df_CLC), .zc_r(C_R2), .clktx(sz_tx), .OPra(ConPra), .PWM1(C_A2),
    .PWM2(C_B2), .zc_t(C_T2), .Cerrd(C2err), .Uhd(C2Uh), .Cit(C2Ceit), .sinFt(C2_sF), .Led_tx(C2_rtled));
  sz_ad_tx inst62 (
    .szres(AD1_RES), .CLKIN(CLKIN), .clcgz(df_CLC), .zc_r(C_R3), .clktx(sz_tx), .OPra(ConPra), .PWM1(C_A3),
    .PWM2(C_B3), .zc_t(C_T3), .Cerrd(C3err), .Uhd(C3Uh), .Cit(C3Ceit), .sinFt(C3_sF), .Led_tx(C3_rtled));
  sz_ad_tx inst65 (
    .szres(AD1_RES), .CLKIN(CLKIN), .clcgz(df_CLC), .zc_r(C_R4), .clktx(sz_tx), .OPra(ConPra), .PWM1(C_A4),
    .PWM2(C_B4), .zc_t(C_T4), .Cerrd(C4err), .Uhd(C4Uh), .Cit(C4Ceit), .sinFt(C4_sF), .Led_tx(C4_rtled));
  sz_ad_tx inst69 (
    .szres(AD1_RES), .CLKIN(CLKIN), .clcgz(df_CLC), .zc_r(C_R5), .clktx(sz_tx), .OPra(ConPra), .PWM1(C_A5),
    .PWM2(C_B5), .zc_t(C_T5), .Cerrd(C5err), .Uhd(C5Uh), .Cit(C5Ceit), .sinFt(C5_sF), .Led_tx(C5_rtled));
  sz_ad_tx inst72 (
    .szres(AD1_RES), .CLKIN(CLKIN), .clcgz(df_CLC), .zc_r(C_R6), .clktx(sz_tx), .OPra(ConPra), .PWM1(C_A6),
    .PWM2(C_B6), .zc_t(C_T6), .Cerrd(C6err), .Uhd(C6Uh), .Cit(C6Ceit), .sinFt(C6_sF), .Led_tx(C6_rtled));
  sz_ad_tx inst79 (
    .szres(AD1_RES), .CLKIN(CLKIN), .clcgz(df_CLC), .zc_r(C_R7), .clktx(sz_tx), .OPra(ConPra), .PWM1(C_A7),
    .PWM2(C_B7), .zc_t(C_T7), .Cerrd(C7err), .Uhd(C7Uh), .Cit(C7Ceit), .sinFt(C7_sF), .Led_tx(C7_rtled));
  dc_HBCON inst12 (
    .RESET(AD1_RES), .CLKIN(CLKIN), .START(sz_sys), .FH_GX(Gx_Rx), .DC1H(A1Uh), .DC2H(A2Uh), .DC3H(A3Uh),
    .DC4H(A4Uh), .DC5H(A5Uh), .DC6H(A6Uh), .DC7H(A7Uh), .Udhe(UhX), .U1I(upsb), .U2I(upsc), .KPall(P6p),
    .KIall(P7p), .KPind(P10p), .KIind(P11p), .Perr(PA_CON), .RST1H(dcA1_tz), .RST2H(dcA2_tz),
    .RST3H(dcA3_tz), .RST4H(dcA4_tz), .RST5H(dcA5_tz), .RST6H(dcA6_tz), .RST7H(dcA7_tz));
  dc_HBCON inst21 (
    .RESET(AD1_RES), .CLKIN(CLKIN), .START(sz_sys), .FH_GX(Gx_Rx), .DC1H(B1Uh), .DC2H(B2Uh), .DC3H(B3Uh),
    .DC4H(B4Uh), .DC5H(B5Uh), .DC6H(B6Uh), .DC7H(B7Uh), .Udhe(UhX), .U1I(upsc), .U2I(upsa), .KPall(P6p),
    .KIall(P7p), .KPind(P10p), .KIind(P11p), .Perr(PB_CON), .RST1H(dcB1_tz), .RST2H(dcB2_tz),
    .RST3H(dcB3_tz), .RST4H(dcB4_tz), .RST5H(dcB5_tz), .RST6H(dcB6_tz), .RST7H(dcB7_tz));
  dc_HBCON inst25 (
    .RESET(AD1_RES), .CLKIN(CLKIN), .START(sz_sys), .FH_GX(Gx_Rx), .DC1H(C1Uh), .DC2H(C2Uh), .DC3H(C3Uh),
    .DC4H(C4Uh), .DC5H(C5Uh), .DC6H(C6Uh), .DC7H(C7Uh), .Udhe(UhX), .U1I(upsa), .U2I(upsb), .KPall(P6p),
    .KIall(P7p), .KPind(P10p), .KIind(P11p), .Perr(PC_CON), .RST1H(dcC1_tz), .RST2H(dcC2_tz),
    .RST3H(dcC3_tz), .RST4H(dcC4_tz), .RST5H(dcC5_tz), .RST6H(dcC6_tz), .RST7H(dcC7_tz));
  PWM_GE inst108 (
    .CLKIN(CLKIN), .CLK128M(clk128m), .START(sz_pwm), .RES(AD1_RES), .Ui_aTZ(uita), .Ui_bTZ(uitb),
    .Ui_cTZ(uitc), .DCa1TZ(dcA1_tz), .DCa2TZ(dcA2_tz), .DCa3TZ(dcA3_tz), .DCa4TZ(dcA4_tz), .DCa5TZ(dcA5_tz),
    .DCa6TZ(dcA6_tz), .DCa7TZ(dcA7_tz), .DCb1TZ(dcB1_tz), .DCb2TZ(dcB2_tz), .DCb3TZ(dcB3_tz),
    .DCb4TZ(dcB4_tz), .DCb5TZ(dcB5_tz), .DCb6TZ(dcB6_tz), .DCb7TZ(dcB7_tz), .DCc1TZ(dcC1_tz),
    .DCc2TZ(dcC2_tz), .DCc3TZ(dcC3_tz), .DCc4TZ(dcC4_tz), .DCc5TZ(dcC5_tz), .DCc6TZ(dcC6_tz),
    .DCc7TZ(dcC7_tz), .PWM1A(A_A1), .PWM_1A(A_B1), .PWM1B(B_A1), .PWM_1B(B_B1), .PWM1C(C_A1), .PWM_1C(C_B1),
    .PWM2A(A_A2), .PWM_2A(A_B2), .PWM2B(B_A2), .PWM_2B(B_B2), .PWM2C(C_A2), .PWM_2C(C_B2), .PWM3A(A_A3),
    .PWM_3A(A_B3), .PWM3B(B_A3), .PWM_3B(B_B3), .PWM3C(C_A3), .PWM_3C(C_B3), .PWM4A(A_A4), .PWM_4A(A_B4),
    .PWM4B(B_A4), .PWM_4B(B_B4), .PWM4C(C_A4), .PWM_4C(C_B4), .PWM5A(A_A5), .PWM_5A(A_B5), .PWM5B(B_A5),
    .PWM_5B(B_B5), .PWM5C(C_A5), .PWM_5C(C_B5), .PWM6A(A_A6), .PWM_6A(A_B6), .PWM6B(B_A6), .PWM_6B(B_B6),
    .PWM6C(C_A6), .PWM_6C(C_B6), .PWM7A(A_A7), .PWM_7A(A_B7), .PWM7B(B_A7), .PWM_7B(B_B7), .PWM7C(C_A7),
    .PWM_7C(C_B7), .TXCLK(sz_tx));
  IO_Detect inst232 (.RES(AD1_RES), .CLK(CLKIN), .DIN(I1), .DOUT(IOSt[0]));
  IO_Detect inst237 (.RES(AD1_RES), .CLK(CLKIN), .DIN(I2), .DOUT(IOSt[1]));
  IO_Detect inst238 (.RES(AD1_RES), .CLK(CLKIN), .DIN(I3), .DOUT(IOSt[2]));
  IO_Detect inst239 (.RES(AD1_RES), .CLK(CLKIN), .DIN(I4), .DOUT(IOSt[3]));
  IO_Detect inst9 (.RES(AD1_RES), .CLK(CLKIN), .DIN(I5), .DOUT(IOSt[4]));
  IO_Detect inst11 (.RES(AD1_RES), .CLK(CLKIN), .DIN(I6), .DOUT(IOSt[5]));
  not inst20 (Q1, IOSt[8]);
  not inst28 (Q2, IOSt[9]);
  not inst29 (Q3, IOSt[10]);
  not inst31 (Q4, IOSt[11]);
  not inst32 (Q5, IOSt[12]);
  not inst39 (Q6, IOSt[13]);

  assign AD2_CONV = AD1_CONV;
  assign AD2_RES = AD1_RES;
  assign OS1_0 = 1'b0;
  assign OS1_1 = 1'b0;
  assign OS1_2 = 1'b0;
  assign OS2_0 = 1'b0;
  assign OS2_1 = 1'b0;
  assign OS2_2 = 1'b0;

  // Other names for the same wires on the sheet: ADCONVST = AD1_CONV; sz_res = AD1_RES; DXINT = DF_IO12

  // Notes on the sheet:
  //   4
  //   5
  //   1
  //   2
  //   4
  //   3
  //   Test
  //   1
  //   4
  //   4
  //   2
  //   5
  //   6
  //   3
  //   7
endmodule
